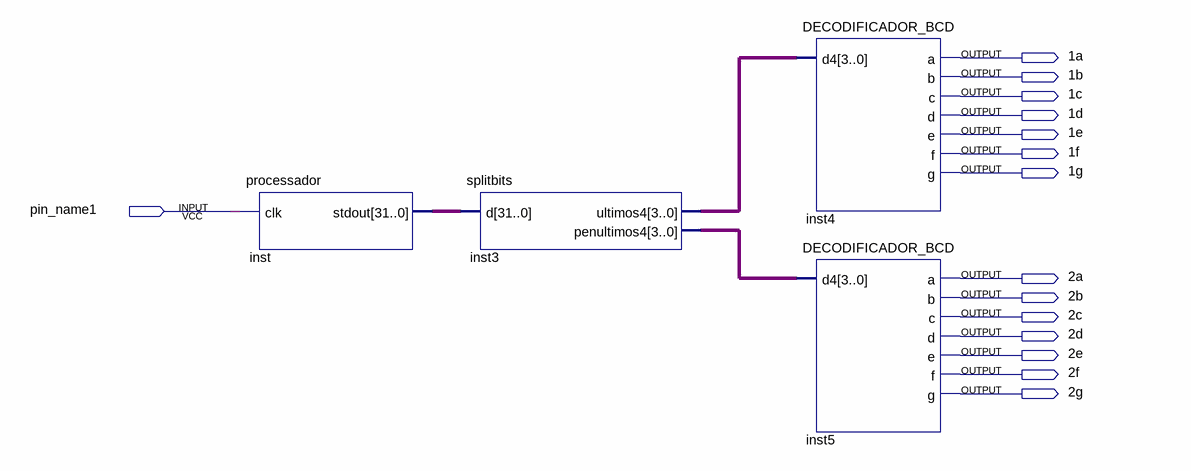
[diagram p0: schematic sheet]
// Quartus schematic visualiza.bdf as structural Verilog: 4 symbols, 15 pins
module visualiza (
  input  pin_name1,
  output \1a ,
  output \1b ,
  output \1c ,
  output \1d ,
  output \1e ,
  output \1f ,
  output \1g ,
  output \2a ,
  output \2b ,
  output \2c ,
  output \2d ,
  output \2e ,
  output \2f ,
  output \2g 
);

  wire [3:0] inst3_penultimos4, inst3_ultimos4;
  wire [31:0] inst_stdout;

  processador inst (.clk(pin_name1), .stdout(inst_stdout));
  splitbits inst3 (.d(inst_stdout), .ultimos4(inst3_ultimos4), .penultimos4(inst3_penultimos4));
  DECODIFICADOR_BCD inst4 (.d4(inst3_ultimos4), .a(\1a ), .b(\1b ), .c(\1c ), .d(\1d ), .e(\1e ), .f(\1f ), .g(\1g ));
  DECODIFICADOR_BCD inst5 (
    .d4(inst3_penultimos4), .a(\2a ), .b(\2b ), .c(\2c ), .d(\2d ), .e(\2e ), .f(\2f ), .g(\2g ));
endmodule
